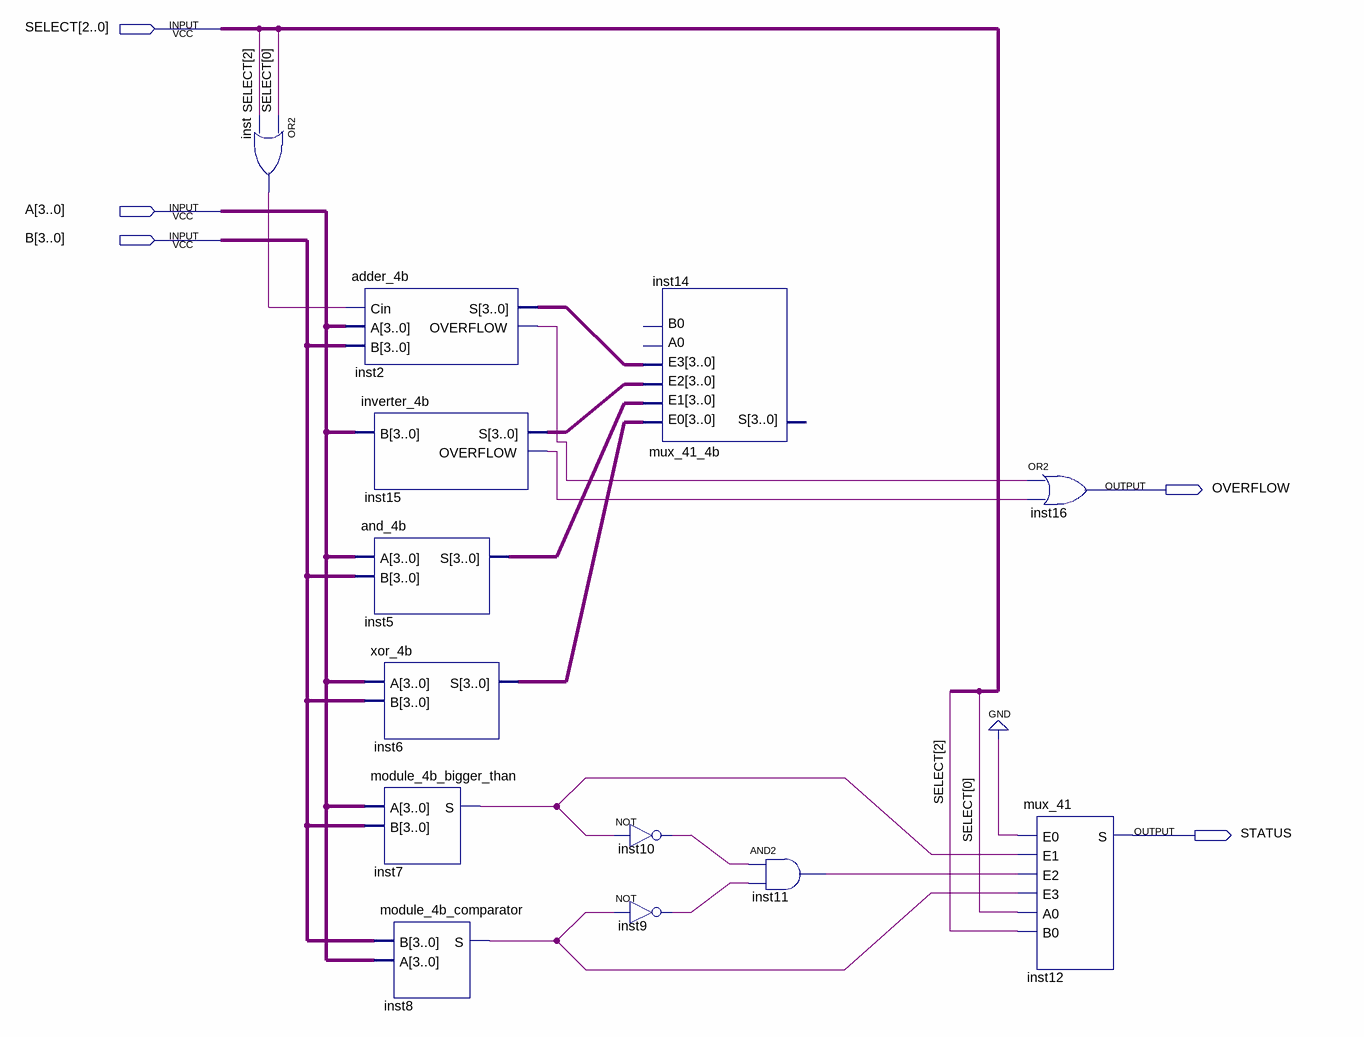
[diagram p0: schematic sheet]
// Quartus schematic ULA.bdf as structural Verilog: 13 symbols, 5 pins
module ULA (
  input  [2:0] SELECT,
  input  [3:0] A,
  input  [3:0] B,
  output OVERFLOW,
  output STATUS
);

  wire inst2_overflow, inst7_s, inst8_s, inst9_out, inst10_out, inst11_out, inst15_overflow, inst_out;
  wire [3:0] inst2_s, inst5_s, inst6_s, inst15_s;

  or inst (inst_out, SELECT[0], SELECT[2]);
  adder_4b inst2 (.Cin(inst_out), .A(A), .B(B), .S(inst2_s), .OVERFLOW(inst2_overflow));
  inverter_4b inst15 (.B(A), .S(inst15_s), .OVERFLOW(inst15_overflow));
  and_4b inst5 (.A(A), .B(B), .S(inst5_s));
  xor_4b inst6 (.A(A), .B(B), .S(inst6_s));
  module_4b_bigger_than inst7 (.A(A), .B(B), .S(inst7_s));
  module_4b_comparator inst8 (.B(B), .A(A), .S(inst8_s));
  mux_41_4b inst14 (.E0(inst6_s), .E1(inst5_s), .E2(inst15_s), .E3(inst2_s));  // open: A0, B0, S
  not inst10 (inst10_out, inst7_s);
  not inst9 (inst9_out, inst8_s);
  and inst11 (inst11_out, inst10_out, inst9_out);
  or inst16 (OVERFLOW, inst2_overflow, inst15_overflow);
  mux_41 inst12 (.E0(1'b0), .E1(inst7_s), .E2(inst11_out), .E3(inst8_s), .A0(SELECT[0]), .B0(SELECT[2]), .S(STATUS));
endmodule
